# Altium project 4ADI_2DO.PrjPCB (part 6 of 6)

## Sheet BG96.SchDoc
size A3
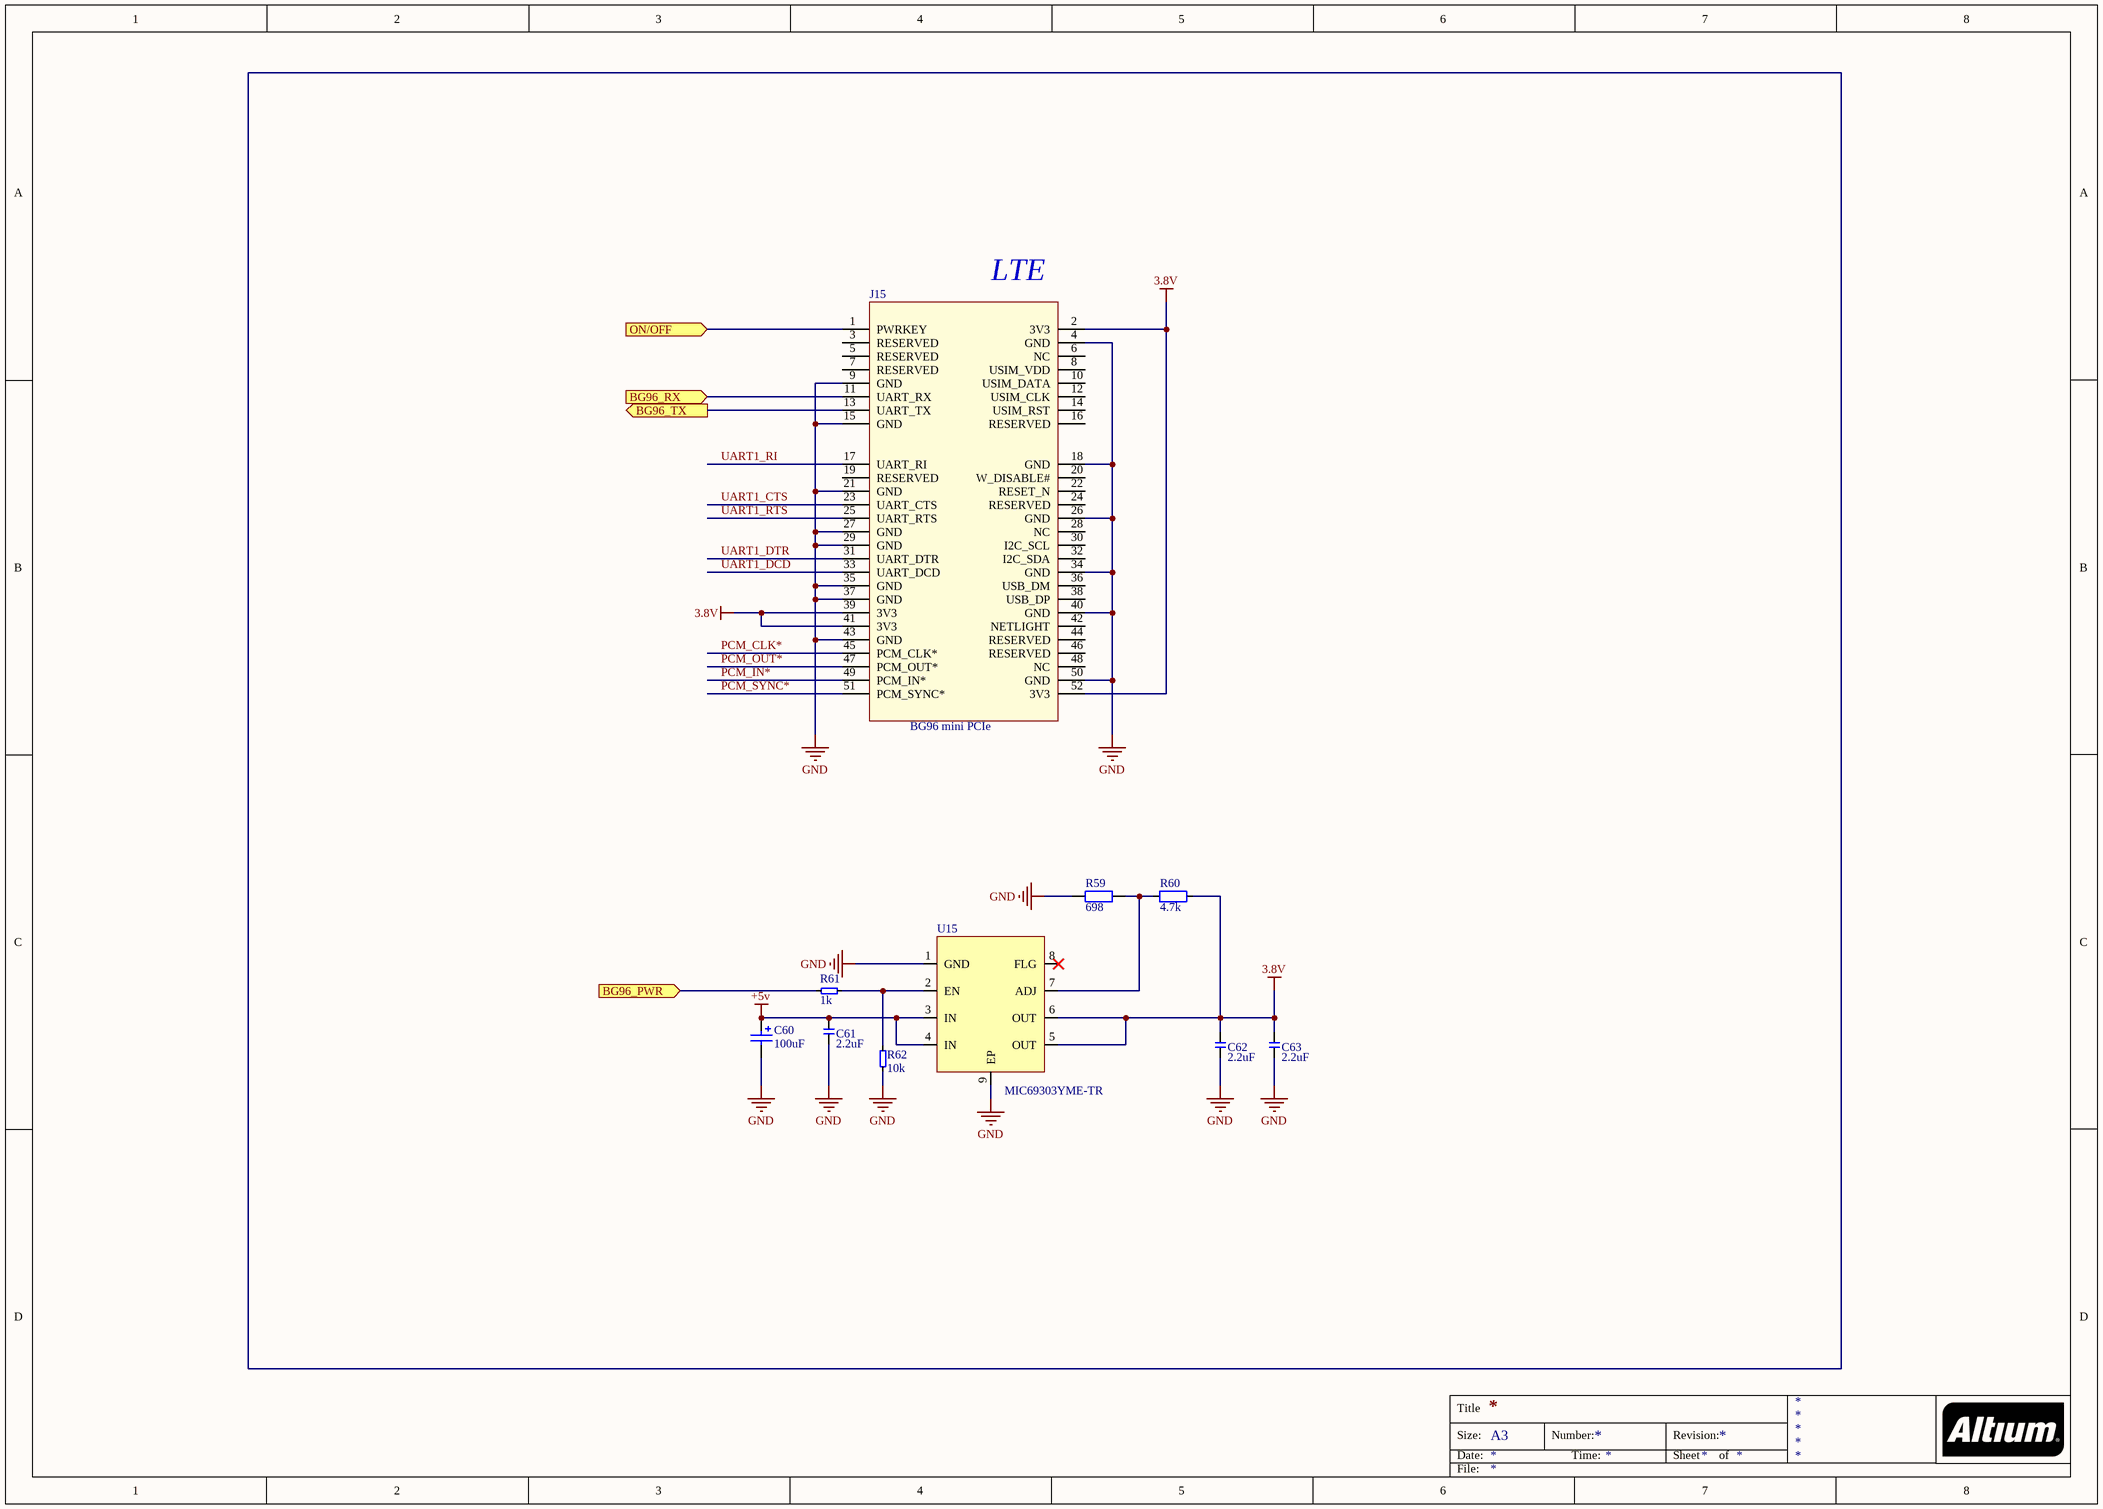
[diagram p7: BG96.SchDoc]

### Parts
C60  100uF  [C_Tantalum_1206_(3.20mm x 1.60mm)]
C61  2.2uF  [C0603]
C62  2.2uF  [C0603]
C63  2.2uF  [C0603]
J15  BG96 mini PCIe  [MiniPCIe_67910-5700]
R59  698  [R0603]
R60  4.7k  [R0603]
R61  1k  [R_0603]
R62  10k  [R_0603]
U15  MIC69303YME-TR  [soic8 PowerPad]

### Ports
BG96_PWR (in), BG96_RX (in), BG96_TX (out), ON/OFF (in)

### Nets
3.8V: C62.2 C63.2 J15.2(3V3) J15.39(3V3) J15.41(3V3) J15.52(3V3) R60.1 U15.5(OUT) U15.6(OUT)
+5v: C60.1 C61.2 U15.3(IN) U15.4(IN)
GND: C60.2 C61.1 C62.1 C63.1 J15.4(GND) J15.9(GND) J15.15(GND) J15.18(GND) J15.21(GND) J15.26(GND) J15.27(GND) J15.29(GND) J15.34(GND) J15.35(GND) J15.37(GND) J15.40(GND) J15.43(GND) J15.50(GND) R59.2 R62.2 U15.1(GND) U15.9(EP)
BG96_RX: J15.11(UART_RX) ; port BG96_RX
BG96_TX: J15.13(UART_TX) ; port BG96_TX
ON/OFF: J15.1(PWRKEY) ; port ON/OFF
PCM_CLK*: J15.45(PCM_CLK*)
PCM_IN*: J15.49(PCM_IN*)
PCM_OUT*: J15.47(PCM_OUT*)
PCM_SYNC*: J15.51(PCM_SYNC*)
UART1_CTS: J15.23(UART_CTS)
UART1_DCD: J15.33(UART_DCD)
UART1_DTR: J15.31(UART_DTR)
UART1_RI: J15.17(UART_RI)
UART1_RTS: J15.25(UART_RTS)
NetR59_1: R59.1 R60.2 U15.7(ADJ)
NetR61_1: R61.1 ; port BG96_PWR
NetR61_2: R61.2 R62.1 U15.2(EN)

Not connected (* = marked no-connect by the designer): J15 3(RESERVED) 5(RESERVED) 6(NC) 7(RESERVED) 8(USIM_VDD) 10(USIM_DATA) 12(USIM_CLK) 14(USIM_RST) 16(RESERVED) 19(RESERVED) 20(W_DISABLE#) 22(RESET_N) 24(RESERVED) 28(NC) 30(I2C_SCL) 32(I2C_SDA) 36(USB_DM) 38(USB_DP) 42(NETLIGHT) 44(RESERVED) 46(RESERVED) 48(NC); U15 8(FLG)*

### Notes on the sheet
- (near J15) LTE
- Title
- Size:
- Date:
- A3
- Number:
- Time:
- Revision:
- Sheet
- of
- File:

### Library data of the parts
C60 = Cap Pol2: CAP TANT 100UF 10% 6.3V 1206; Manufacturer: Kyocera AVX; Manufacturer Part Number: F930J107KAA; ESR (Equivalent Series Resistance): 2R; Life (Hours): 2000Hour; Supplier 1: Digi-Key; Supplier Part Number 1: 478-8152-1-ND; Stock 1: 37998; Pricing 1: 1=0.65, 10=0.477, 100=0.3268, 500=0.2587, 1000=0.21786 (USD); Mount: Surface Mount; Case/Package: 1206; Case Code (Imperial): 1206; Case Code (Metric): 3216; Min Operating Temperature: -55°C; Max Operating Temperature: 125°C; Features: General Purpose; Packaging: Tape and Reel; Capacitance: 100uF; Tolerance: 10%; Voltage Rating: 6.3V
C61-C63 = CAP_0603: CAP CER 2.2UF 10V X7R 0603; Manufacturer: Samsung; Manufacturer Part Number: CL10B225KP8NNNC; Material: Ceramic; Tolerance: 10%; Supplier 1: Digi-Key; Supplier Part Number 1: 1276-1134-1-ND; Stock 1: 529713; Pricing 1: 1=0.18, 10=0.128, 100=0.06, 500=0.0421, 1000=0.03485 (USD); Mount: Surface Mount; Case/Package: 0603; Case Code (Metric): 1608; Case Code (Imperial): 0603; Contact Plating: Tin; Min Operating Temperature: -55°C; Max Operating Temperature: 125°C; Package Quantity: 1; Packaging: Tape and Reel; Capacitance: 2.2uF; Voltage Rating: 10V; Dielectric: X7R; Length: 1.6mm; Height: 0.8mm; Width: 0.031inch; Thickness: 0.035inch; Depth: 0.8mm; Radiation Hardening: No; ComponentLink1URL: https://media.digikey.com/pdf/Data%20Sheets/Samsung%20PDFs/CL_Series_MLCC_ds.pdf?src-supplier=Digi-Key; ComponentLink1Description: https://media.digikey.com/pdf/Data%20Sheets/Samsung%20PDFs/CL_Series_MLCC_ds.pdf?src-supplier=Digi-Key; ComponentLink2URL: http://www1.futureelectronics.com/doc/SAMSUNG/CL10B225KP8NNNC.pdf?src-supplier=Future+Electronics; ComponentLink2Description: http://www1.futureelectronics.com/doc/SAMSUNG/CL10B225KP8NNNC.pdf?src-supplier=Future+Electronics; ComponentLink3URL: https://www.verical.com/server-webapp/html/getDatasheet?partID=359568&src-supplier=Verical; ComponentLink3Description: https://www.verical.com/server-webapp/html/getDatasheet?partID=359568&src-supplier=Verical; ComponentLink4URL: https://produktinfo.conrad.com/datenblaetter/450000-474999/457933-da-01-en-VS_KONDENSATOR_0603.pdf?src-supplier=Conrad; ComponentLink4Description: https://produktinfo.conrad.com/datenblaetter/450000-474999/457933-da-01-en-VS_KONDENSATOR_0603.pdf?src-supplier=Conrad
J15 = BG96 mini PCIe: LTE duaghter board; Manufacturer: Texas Instruments; Manufacturer Part Number: TPS54561DPRR; Switching Frequency: 2.5MHz; Number of Outputs: 1; Output Voltage: 59V; Max Output Current: 5A; Min Input Voltage: 4.5V; Max Input Voltage: 60V; Synchronous Rectifier: No; Min Output Voltage: 800mV; Quiescent Current: 152uA; Output Type: Adjustable; Output Configuration: Positive; Supplier 1: Digi-Key; Supplier Part Number 1: 296-40803-1-ND; Stock 1: 14195; Pricing 1: 1=5.52, 10=4.962, 100=4.0652, 500=3.46064, 1000=2.91861 (USD); Mount: Surface Mount; Number of Pins: 10; Min Operating Temperature: -40°C; Max Operating Temperature: 125°C; Package Quantity: 3000; Packaging: Tape and Reel; Output Current: 5A; Max Output Voltage: 59V; Operating Supply Voltage: 60V; Radiation Hardening: No; Lead Free: Lead Free; ComponentLink1URL: http://www.ti.com/lit/ds/symlink/tps54561.pdf?src-supplier=Digi-Key; ComponentLink1Description: http://www.ti.com/lit/ds/symlink/tps54561.pdf?src-supplier=Digi-Key; ComponentLink2URL: http://www.ti.com/lit/ds/symlink/tps54561.pdf?src-supplier=Avnet; ComponentLink2Description: http://www.ti.com/lit/ds/symlink/tps54561.pdf?src-supplier=Avnet
R59 = Res2: RES SMD 698 OHM 1% 1/10W 0603; Manufacturer: Yageo; Manufacturer Part Number: RC0603FR-07698RL; Supplier 1: Digi-Key; Supplier Part Number 1: 311-698HRCT-ND
R60 = Res_0603: RES SMD 4.7K OHM 1% 1/10W 0603; Manufacturer: Yageo Phycomp; Manufacturer Part Number: RC0603FR-074K7L; Temperature Coefficient: 100ppm/°C; Voltage Rating (DC): 50V; Resistance: 4.7kR; Power Rating: 100mW; Supplier 1: Digi-Key; Supplier Part Number 1: 311-4.70KHRCT-ND; Stock 1: 19144100; Pricing 1: 1=0.1, 10=0.024, 100=0.0097, 1000=0.00437, 2500=0.00379 (USD); Mount: Surface Mount; Case/Package: 0603; Number of Pins: 2; Min Operating Temperature: -55°C; Max Operating Temperature: 155°C; Tolerance: 1%; Packaging: Cut Tape; Length: 1.6mm; Height: 0.45mm; Width: 800um; Depth: 0.8mm; REACH SVHC: No SVHC; Lead Free: Lead Free
R61 = R_0402: RES SMD 1K OHM 1% 1/10W 0603; Manufacturer: Yageo; Manufacturer Part Number: RC0603FR-071KL; ComponentLink1URL: http://documents.rs-components.com/techlib://itc_doclist_GB.htm?stockno=6186122&src-supplier=RSComponents; ComponentLink1Description: http://documents.rs-components.com/techlib://itc_doclist_GB.htm?stockno=6186122&src-supplier=RSComponents; ComponentLink2URL: http://www.mouser.com/ds/2/447/PYu-RC0402_51_RoHS_L_6_r-8721.pdf?src-supplier=Mouser; ComponentLink2Description: http://www.mouser.com/ds/2/447/PYu-RC0402_51_RoHS_L_6_r-8721.pdf?src-supplier=Mouser; ComponentLink3URL: http://www.yageo.com/documents/recent/PYu-RC0402_51_RoHS_L_6_r.pdf?src-supplier=Future+Electronics; ComponentLink3Description: http://www.yageo.com/documents/recent/PYu-RC0402_51_RoHS_L_6_r.pdf?src-supplier=Future+Electronics; ComponentLink4URL: http://www.farnell.com/datasheets/1018594.pdf?src-supplier=Element14; ComponentLink4Description: http://www.farnell.com/datasheets/1018594.pdf?src-supplier=Element14; ComponentLink5URL: http://www.farnell.com/datasheets/2167052.pdf?src-supplier=Element14; ComponentLink5Description: http://www.farnell.com/datasheets/2167052.pdf?src-supplier=Element14; Supplier 1: Digi-Key; Supplier Part Number 1: 311-1.00KHRCT-ND
R62 = R_0402: RES SMD 10K OHM 1% 1/10W 0603; Manufacturer: Yageo; Manufacturer Part Number: RC0603FR-0710KL; ComponentLink1URL: http://www.farnell.com/datasheets/2167052.pdf?src-supplier=Element14; ComponentLink1Description: http://www.farnell.com/datasheets/2167052.pdf?src-supplier=Element14; ComponentLink2URL: http://www.farnell.com/datasheets/1784430.pdf?src-supplier=Element14; ComponentLink2Description: http://www.farnell.com/datasheets/1784430.pdf?src-supplier=Element14; ComponentLink3URL: http://documents.rs-components.com/techlib://itc_doclist_GB.htm?stockno=6185832&src-supplier=RSComponents; ComponentLink3Description: http://documents.rs-components.com/techlib://itc_doclist_GB.htm?stockno=6185832&src-supplier=RSComponents; ComponentLink4URL: http://www.yageo.com/documents/recent/PYu-RC0402_51_RoHS_L_6_r.pdf?src-supplier=Future+Electronics; ComponentLink4Description: http://www.yageo.com/documents/recent/PYu-RC0402_51_RoHS_L_6_r.pdf?src-supplier=Future+Electronics; ComponentLink5URL: http://www.farnell.com/datasheets/1686128.pdf?src-supplier=Element14; ComponentLink5Description: http://www.farnell.com/datasheets/1686128.pdf?src-supplier=Element14; ComponentLink6URL: http://www.farnell.com/datasheets/1018594.pdf?src-supplier=Element14; ComponentLink6Description: http://www.farnell.com/datasheets/1018594.pdf?src-supplier=Element14; ComponentLink7URL: http://www.yageo.com/documents/recent/PYu-RC_Group_51_RoHS_L_9.pdf?src-supplier=Mouser; ComponentLink7Description: http://www.yageo.com/documents/recent/PYu-RC_Group_51_RoHS_L_9.pdf?src-supplier=Mouser; Supplier 1: Digi-Key; Supplier Part Number 1: 311-10.0KHRCT-ND
U15 = MIC69303YME-TR: IC REG LINEAR POS ADJ 3A 8SOIC; Manufacturer: Microchip Technology; Manufacturer Part Number: MIC69303YME-TR; Supplier 1: Digi-Key; Supplier Part Number 1: 576-3224-1-ND

## Nets that join several sheets
+3V3: main board (53 pins), power supply (R52.2 R55.2), AnalogOutputs (5 pins)
+3V3_A: main board (5 pins), ISOinputs (C71.2 C76.2 U21.5 U24.5)
+5v: main board (17 pins), power supply (12 pins), AnalogOutputs (6 pins), ISOinputs (FB4.2 R75.2 R76.2 R77.2), BG96 (C60.1 C61.2 U15.3 U15.4)
AGND: main board (C9.1 FB1.2 U3.20), ISOinputs (26 pins)
GND: main board (96 pins), power supply (32 pins), AnalogOutputs (11 pins), BG96 (22 pins)
ADIN_11: main board (U3.16), ISOinputs (C69.2 R74.2)
AnalogEN: main board (U3.5), ISOinputs (R76.1 U19.6)
AnalogSEL1: main board (U3.10), ISOinputs (R77.1 U19.11)
AnalogSEL2: main board (U3.11), ISOinputs (R75.1 U19.10)
BG96_RX: main board (U7.3), BG96 (J15.11)
BG96_TX: main board (U5.3), BG96 (J15.13)
NetJ12_2: main board (U3.96), power supply (J12.2)
NetJ12_3: main board (U3.95), power supply (J12.3)
NetR44_1: main board (U3.54), power supply (R44.1)
NetR52_1: main board (U3.61), power supply (R52.1 U12.1)
NetR55_1: main board (U3.78), power supply (R55.1 U13.4)
NetR61_1: main board (U3.42), BG96 (R61.1)
NetR89_2: main board (U3.69), AnalogOutputs (R89.2 R94.2 U26.4 U27.4)
NetR90_2: main board (U3.68), AnalogOutputs (R90.2 R95.2 U26.5 U27.5)
NetU3_60: main board (U3.60), power supply (U12.2 U12.3)
NetU3_62: main board (U3.62), power supply (U12.4)
NetU3_79: main board (U3.79), power supply (U13.1)
ON/OFF: main board (U3.38), BG96 (J15.1)